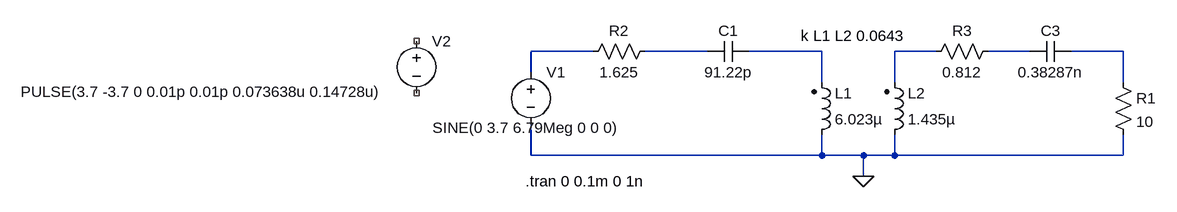
[diagram p0: schematic WPT_Coupled.asc]
WPT_Coupled.asc, the LTspice schematic file:
Version 4
SHEET 1 2368 796
WIRE 32 112 -64 112
WIRE 208 112 112 112
WIRE 384 112 272 112
WIRE 560 112 496 112
WIRE 704 112 640 112
WIRE 848 112 768 112
WIRE -64 144 -64 112
WIRE 384 160 384 112
WIRE 496 160 496 112
WIRE 848 160 848 112
WIRE -64 272 -64 224
WIRE 384 272 384 240
WIRE 384 272 -64 272
WIRE 448 272 384 272
WIRE 496 272 496 240
WIRE 496 272 448 272
WIRE 848 272 848 240
WIRE 848 272 496 272
WIRE 448 304 448 272
FLAG 448 304 0
SYMBOL voltage -64 128 R0
WINDOW 123 0 0 Left 0
WINDOW 39 0 0 Left 0
WINDOW 3 -151 101 Left 2
SYMATTR Value SINE(0 3.7 6.79Meg 0 0 0)
SYMATTR InstName V1
SYMBOL cap 272 96 R90
WINDOW 0 0 32 VBottom 2
WINDOW 3 32 32 VTop 2
SYMATTR InstName C1
SYMATTR Value 91.22p
SYMBOL ind2 368 256 M180
WINDOW 0 36 80 Left 2
WINDOW 3 36 40 Left 2
SYMATTR InstName L1
SYMATTR Value 6.023µ
SYMATTR Type ind
SYMBOL ind2 480 256 M180
WINDOW 0 36 80 Left 2
WINDOW 3 36 40 Left 2
SYMATTR InstName L2
SYMATTR Value 1.435µ
SYMATTR Type ind
SYMBOL res 128 96 R90
WINDOW 0 0 56 VBottom 2
WINDOW 3 32 56 VTop 2
SYMATTR InstName R2
SYMATTR Value 1.625
SYMBOL res 656 96 R90
WINDOW 0 0 56 VBottom 2
WINDOW 3 32 56 VTop 2
SYMATTR InstName R3
SYMATTR Value 0.812
SYMBOL cap 768 96 R90
WINDOW 0 0 32 VBottom 2
WINDOW 3 32 32 VTop 2
SYMATTR InstName C3
SYMATTR Value 0.38287n
SYMBOL res 832 144 R0
SYMATTR InstName R1
SYMATTR Value 10
SYMBOL voltage -240 80 R0
WINDOW 123 0 0 Left 0
WINDOW 39 0 0 Left 0
WINDOW 3 -609 94 Left 2
SYMATTR Value PULSE(3.7 -3.7 0 0.01p 0.01p 0.073638u 0.14728u)
SYMATTR InstName V2
TEXT 352 88 Left 2 !k L1 L2 0.0643
TEXT -72 312 Left 2 !.tran 0 0.1m 0 1n

The netlist it stands for:
* WPT_Coupled.asc
V1 N001 0 SINE(0 3.7 6.79Meg 0 0 0)
C1 N003 N002 91.22p
L1 0 N003 6.023µ
L2 0 N004 1.435µ
R2 N002 N001 1.625
R3 N005 N004 0.812
C3 N006 N005 0.38287n
R1 N006 0 10
V2 NC_01 NC_02 PULSE(3.7 -3.7 0 0.01p 0.01p 0.073638u 0.14728u)
k L1 L2 0.0643
.tran 0 0.1m 0 1n
.backanno
.end